# Altium schematic sheet Absolute Encoder.SchDoc
size A4; CompanyName: Technische Hochschule Nürnberg Georg Simon Ohm; Organization: UltraZohm; Address1: Kesslerplatz 12; Address2: 90489 Nürnberg; Address3: GERMANY; DocumentNumber: 2; SheetNumber: 2; SheetTotal: 12; Website: www.ultrazohm.com
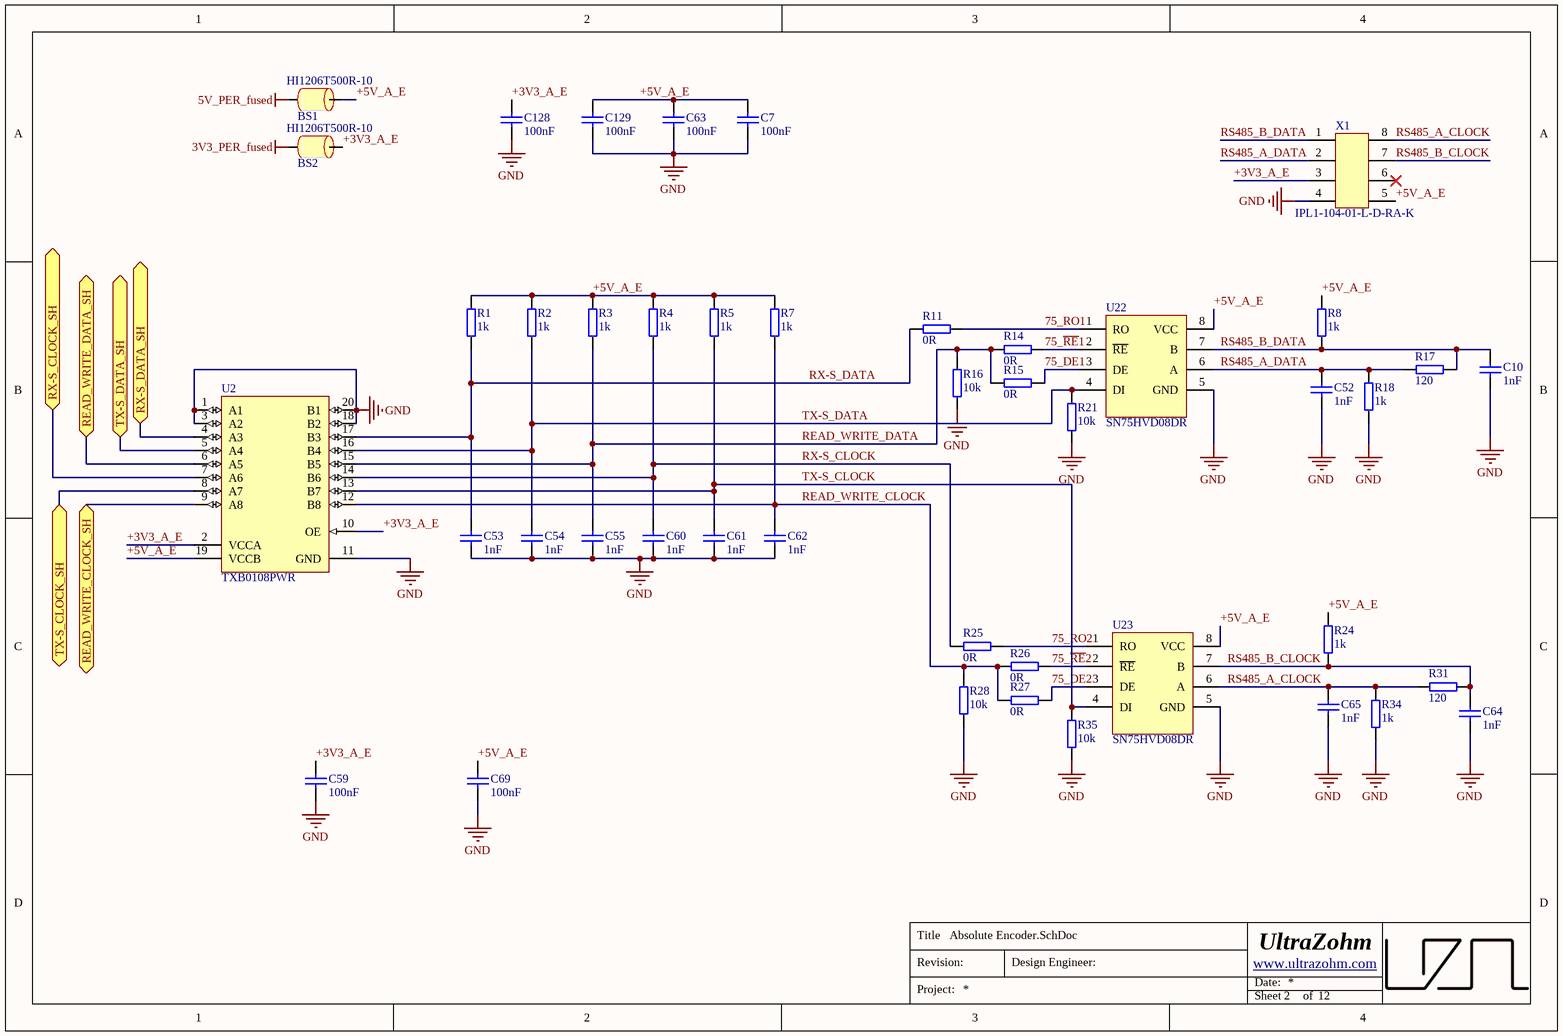
[diagram p0: Absolute Encoder.SchDoc]

## Parts
BS1  HI1206T500R-10  [RES_1206]
BS2  HI1206T500R-10  [RES_1206]
C7  100nF  [CAPC1608X07N]
C10  1nF  [CAPC1608X07N]
C52  1nF  [CAPC1608X07N]
C53  1nF  [CAPC1608X07N]
C54  1nF  [CAPC1608X07N]
C55  1nF  [CAPC1608X07N]
C59  100nF  [CAPC1608X07N]
C60  1nF  [CAPC1608X07N]
C61  1nF  [CAPC1608X07N]
C62  1nF  [CAPC1608X07N]
C63  100nF  [CAPC1608X07N]
C64  1nF  [CAPC1608X07N]
C65  1nF  [CAPC1608X07N]
C69  100nF  [CAPC1608X07N]
C128  100nF  [CAPC1608X07N]
C129  100nF  [CAPC1608X07N]
R1  1k  [RESC1608X06N]
R2  1k  [RESC1608X06N]
R3  1k  [RESC1608X06N]
R4  1k  [RESC1608X06N]
R5  1k  [RESC1608X06N]
R7  1k  [RESC1608X06N]
R8  1k  [RESC1608X06N]
R11  0R  [RESC1608X06N]
R14  0R  [RESC1608X06N]
R15  0R  [RESC1608X06N]
R16  10k  [RESC1608X06N]
R17  120  [RESC1608X06N]
R18  1k  [RESC1608X06N]
R21  10k  [RESC1608X06N]
R24  1k  [RESC1608X06N]
R25  0R  [RESC1608X06N]
R26  0R  [RESC1608X06N]
R27  0R  [RESC1608X06N]
R28  10k  [RESC1608X06N]
R31  120  [RESC1608X06N]
R34  1k  [RESC1608X06N]
R35  10k  [RESC1608X06N]
U2  TXB0108PWR  [PW0020A_L]
U22  SN75HVD08DR  [SOIC8_N]
U23  SN75HVD08DR  [SOIC8_N]
X1  IPL1-104-01-L-D-RA-K  [Conector 4x2 TH Horizontal]

## Ports
READ_WRITE_CLOCK_SH (bidir), READ_WRITE_DATA_SH (bidir), RX-S_CLOCK_SH (bidir), RX-S_DATA_SH (bidir), TX-S_CLOCK_SH (bidir), TX-S_DATA_SH (bidir)

## Nets
3V3_PER_fused: BS2.2
5V_PER_fused: BS1.2
GND: C7.2 C10.2 C52.2 C53.2 C54.2 C55.2 C59.2 C60.2 C61.2 C62.2 C63.2 C64.2 C65.2 C69.2 C128.2 C129.2 R16.1 R18.1 R21.1 R28.1 R34.1 R35.1 U2.1(A1) U2.3(A2) U2.11(GND) U2.18(B2) U2.20(B1) U22.5(GND) U23.5(GND) X1.4
75_DE1: R15.2 U22.3(DE)
75_DE2: R27.2 U23.3(DE)
75_~{RE}1: R14.2 U22.2(~{RE})
75_~{RE}2: R26.2 U23.2(~{RE})
75_RO1: R11.2 U22.1(RO)
75_RO2: R25.2 U23.1(RO)
+3V3_A_E: BS2.1 C59.1 C128.1 U2.2(VCCA) U2.10(OE) X1.3
+5V_A_E: BS1.1 C7.1 C63.1 C69.1 C129.1 R1.2 R2.2 R3.2 R4.2 R5.2 R7.2 R8.2 R24.2 U2.19(VCCB) U22.8(VCC) U23.8(VCC) X1.5
READ_WRITE_CLOCK: C62.1 R7.1 R26.1 R27.1 R28.2 U2.12(B8)
READ_WRITE_CLOCK_SH: U2.9(A8) ; port READ_WRITE_CLOCK_SH
READ_WRITE_DATA: C55.1 R3.1 R14.1 R15.1 R16.2 U2.15(B5)
READ_WRITE_DATA_SH: U2.6(A5) ; port READ_WRITE_DATA_SH
RS485_A_CLOCK: C65.1 R31.2 R34.2 U23.6(A) X1.8
RS485_A_DATA: C52.1 R17.2 R18.2 U22.6(A) X1.2
RS485_B_CLOCK: C64.1 R24.1 R31.1 U23.7(B) X1.7
RS485_B_DATA: C10.1 R8.1 R17.1 U22.7(B) X1.1
RX-S_CLOCK: C60.1 R4.1 R25.1 U2.14(B6)
RX-S_CLOCK_SH: U2.7(A6) ; port RX-S_CLOCK_SH
RX-S_DATA: C53.1 R1.1 R11.1 U2.17(B3)
RX-S_DATA_SH: U2.4(A3) ; port RX-S_DATA_SH
TX-S_CLOCK: C61.1 R5.1 R35.2 U2.13(B7) U23.4(DI)
TX-S_CLOCK_SH: U2.8(A7) ; port TX-S_CLOCK_SH
TX-S_DATA: C54.1 R2.1 R21.2 U2.16(B4) U22.4(DI)
TX-S_DATA_SH: U2.5(A4) ; port TX-S_DATA_SH

Not connected (* = marked no-connect by the designer): X1 6*

## Notes on the sheet
- Title
- Revision:
- Design Engineer:
- Date:
- Project:
- Sheet
- of

## Library data of the parts
BS1 BS2 = Bead: Ferrite bead 6A; MF: Laird; Supplier Part Number 2: 240-2412-1-ND; MFN: HI1206T500R-10; Supplier 2: Digi-Key; Supplier 1: Mouser; Supplier Part Number 1: 875-HI1206T500R-10; Package: 1206
C7 C63 C69 C129 = Cap_0603: MPN: 885012206071; MF: Würth; Voltage: 16V; Value: 100nF; Supplier 1: Mouser; Supplier 2: *; Supplier Part Number 1: 710-885012206071; Supplier Part Number 2: *
C10 C52 C64 C65 = Cap_0603: Voltage: 16V; Value: 1nF; MF: *; MPN: *; Supplier 1: *; Supplier 2: *; Supplier Part Number 1: *; Supplier Part Number 2: *
C53-C55 C59-C62 C128 = Cap_0603: MPN: 885012206071; MF: Würth; Voltage: 25V; Supplier 1: Mouser; Supplier 2: *; Supplier Part Number 1: 710-885012206071; Supplier Part Number 2: *
  C53-C55 C60-C62: Value: 1nF
  C59 C128: Value: 100nF
R1-R5 R7 R8 R18 R24 R34 = R_0603: MPN: RC0603FR-071KL; MF: Yageo; Value: 1k; Supplier 1: Mouser; Supplier Part Number 1: 603-RC0603FR-071KL
R11 R14-R16 R21 R25-R28 R35 = R_0603: MPN: CRCW06030000Z0EAC; MF: Vishay; Supplier 1: Mouser; Supplier Part Number 1: 71-CRCW06030000Z0EAC
  R11 R14 R15 R25-R27: Value: 0R
  R16 R21 R28 R35: Value: 10k
R17 R31 = R_0603: Value: 120; MF: *; MPN: *; Supplier 1: *; Supplier Part Number 1: *
U2 = CMP-2000-07337-1: TXB0108 8-Bit Bidirectional Voltage-Level Translator with Auto-Direction Sensing and / +/- 15-kV ESD Protection, 1.2 to 3.6 V, -40 to 85 degC, 20-Pin TSSOP (PW), Green (RoHS & no Sb/Br), Tape and Reel; Manufacturer: Texas Instruments; Propagation Delay (Max): 4ns; Logic Function: Translator,Bidirectional; Input Type: Logic; Package Version: 4040064-5/G, 02/2011; Voltage - Supply: 1.2V~3.6V,1.65V~5.5V; Data Rate: 100Mbps; Other Names: 296-21527-6; Number of Channels: 8; Differential - Input: Output:No/No; Number of Outputs/Channel: 1; Product Training Modules: VoltageLevelTranslation; Dynamic Catalog: TXBSeries; Package Reference: PW20; Package Description: 20-Pin Small Outline Package Integrated Circuit, Body 6.5 x 4.4 mm, Pitch 0.65 mm; Category: IntegratedCircuits(ICs); Datasheet URL: http://www.ti.com/general/docs/lit/getliterature.tsp?genericPartNumber=TXB0108&fileType=pdf; Package / Case: 20-TSSOP(0.173",4.40mmWidth); Family: Logic-Translators; Standard Package: 1; Series: -; Manufacturer URL: http://www.ti.com/; Number of Bits: 8; Package URL: http://www.ti.com/litv/pdf/mpds362; Output Type: Logic; Datasheet Version: Rev. F, 12/2014; Packaging: Digi-Reel®; Operating Temperature: -40°C~85°C; Supplier Device Package: 20-TSSOP; Mounting Technology: SurfaceMount
U22 U23 = Transmisor RS485: IC TRANSCEIVER HALF 1/1 8SOIC; MF: Texas Instruments; Supplier Part Number 2: 296-37893-1-ND; MPN: SN75HVD08DR; Supplier Part Number 1: 595-SN75HVD08DR; Package: SOIC-8; Supplier 1: Mouser; Supplier 2: Digi-Key
X1 = Conector 4x2 Horizontal: CONN HEADER R/A 8POS 2.54MM Through Hole; MF: Samtec; Supplier Part Number 2: SAM9596-ND; MPN: IPL1-104-01-L-D-RA-K; Supplier Part Number 1: 200-IPL110401LDRAK; Supplier 1: Mouser; Supplier 2: Digi-Key